# EAGLE design IR_Sync_Emitter with sensor (EAGLE 6.3)
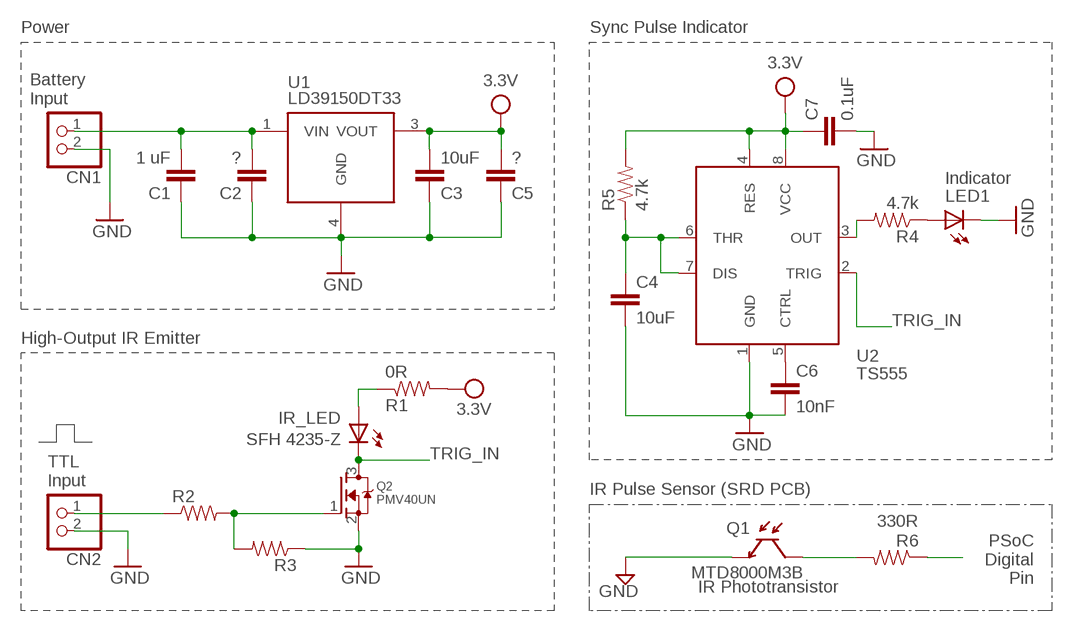
[diagram p0: schematic, sheet 1]

## Parts
C1  1 uF  CC0805-N  [CAPC2012X100N]
C2  ?  CC0805-N  [CAPC2012X100N]
C3  10uF  CC0805-N  [CAPC2012X100N]
C4  10uF  CC0805-N  [CAPC2012X100N]
C5  ?  CC0805-N  [CAPC2012X100N]
C6  10nF  CC0805-N  [CAPC2012X100N]
C7  0.1uF  CC0805-N  [CAPC2012X100N]
CN1  JST_2PIN-SMT-RA  [JST-PH-2-SMT-RA]
CN2  JST_2PIN-SMT-RA  [JST-PH-2-SMT-RA]
IR_LED  LEDIR_SMT16.2X11.2  [LED_SMT6.2X11.2]
LED1  LED0603  [CHIPLED_0603]
Q1  MTD8000M3B  PHOTOTRANSISTOR  [MTD8000M3B-T]
Q2  PMV40UN  MOSFET-NREFLOW  [SOT23]
R1  0R  RR1206-N  [RESC3116X65N]
R2  RR0805-N  [RESC2012X60N]
R3  RR0805-N  [RESC2012X60N]
R4  4.7k  RR0805-N  [RESC2012X60N]
R5  4.7k  RR0805-N  [RESC2012X60N]
R6  330R  RR0805-N  [RESC2012X60N]
U1  LM2931_FIXED  [DPAK]
U2  TS555  [SO08]

## Nets
GND: C1.1 C2.1 C3.1 C4.2 C5.1 C6.2 C7.2 CN1.2 CN2.2 LED1.C Q1.E Q2.2(S) R3.1 U1.4(GND) U2.1(GND)
N$2: LED1.A R4.1
N$3: Q2.1(G) R2.2 R3.2
N$4: C1.2 C2.2 CN1.1 U1.1(VIN)
N$5: IR_LED.A R1.1
N$6: Q1.C R6.2
N$7: CN2.1 R2.1
N$8: R6.1
N$9: R4.2 U2.3(OUT)
N$10: C4.1 R5.1 U2.6(THR) U2.7(DIS)
N$11: C6.1 U2.5(CTRL)
TRIG_IN: IR_LED.C Q2.3(D) U2.2(TRIG)
VDD: C3.2 C5.2 C7.1 R1.2 R5.2 U1.3(VOUT) U2.4(RES) U2.8(VCC)

## Notes on the sheet
- Power | Sync Pulse Indicator
- 3.3V
- 3.3V
- Battery
  Input
- LD39150DT33
- Indicator
- High-Output IR Emitter
- 3.3V
- SFH 4235-Z
- TTL
  Input
- IR Pulse Sensor (SRD PCB)
- PSoC
  Digital
  Pin
- IR Phototransistor

## Library data of the parts
C1-C7 = Ramshur:C: Capacitor (english/metric) cermaic capacitor nominal landpattern (N).
CN1 CN2 = _adafruit:JST_2PIN: JST 2-Pin Connectors of various flavors SMT-RA (S2B-PH-SM4) 4UConnector #17311 SMT (B2B-PH-SM4) THM-RA (S2B-PH) THM (B2B-PH)
IR_LED LED1 = Ramshur:LED: LED
Q1 = Ramshur:PHOTOTRANSISTOR: phototransistor
Q2 = _adafruit:MOSFET-N: N-Channel Mosfet 2N7002E - 60V 260mA SOT23 [Digikey: 2N7002ET1GOSTR-ND] - REEL BSH103 - 30V 850mA SOT23 [Digikey: 568-5013-1-ND]
R1-R6 = Ramshur:R: Resistor Basic schematic elements and footprints for 0603, 1206, and PTH resistors.
U1 = SparkFun-PowerIC:LM2931_FIXED: LDO regulator with reverse battery protection- very durable!
U2 = Ramshur:TS555

## Board
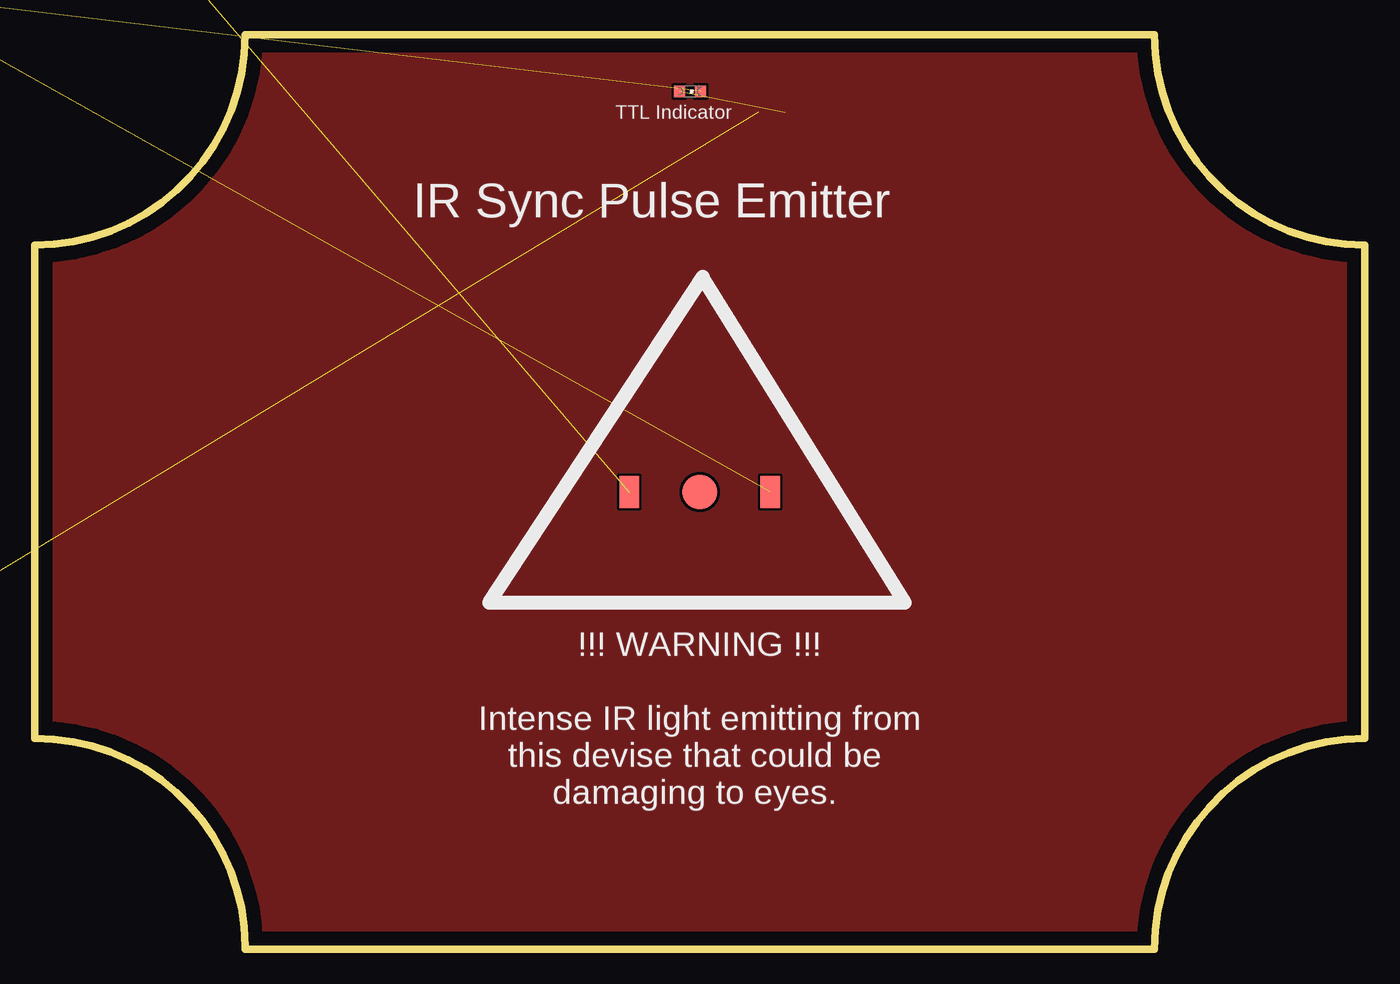
[diagram p1: board, top side]
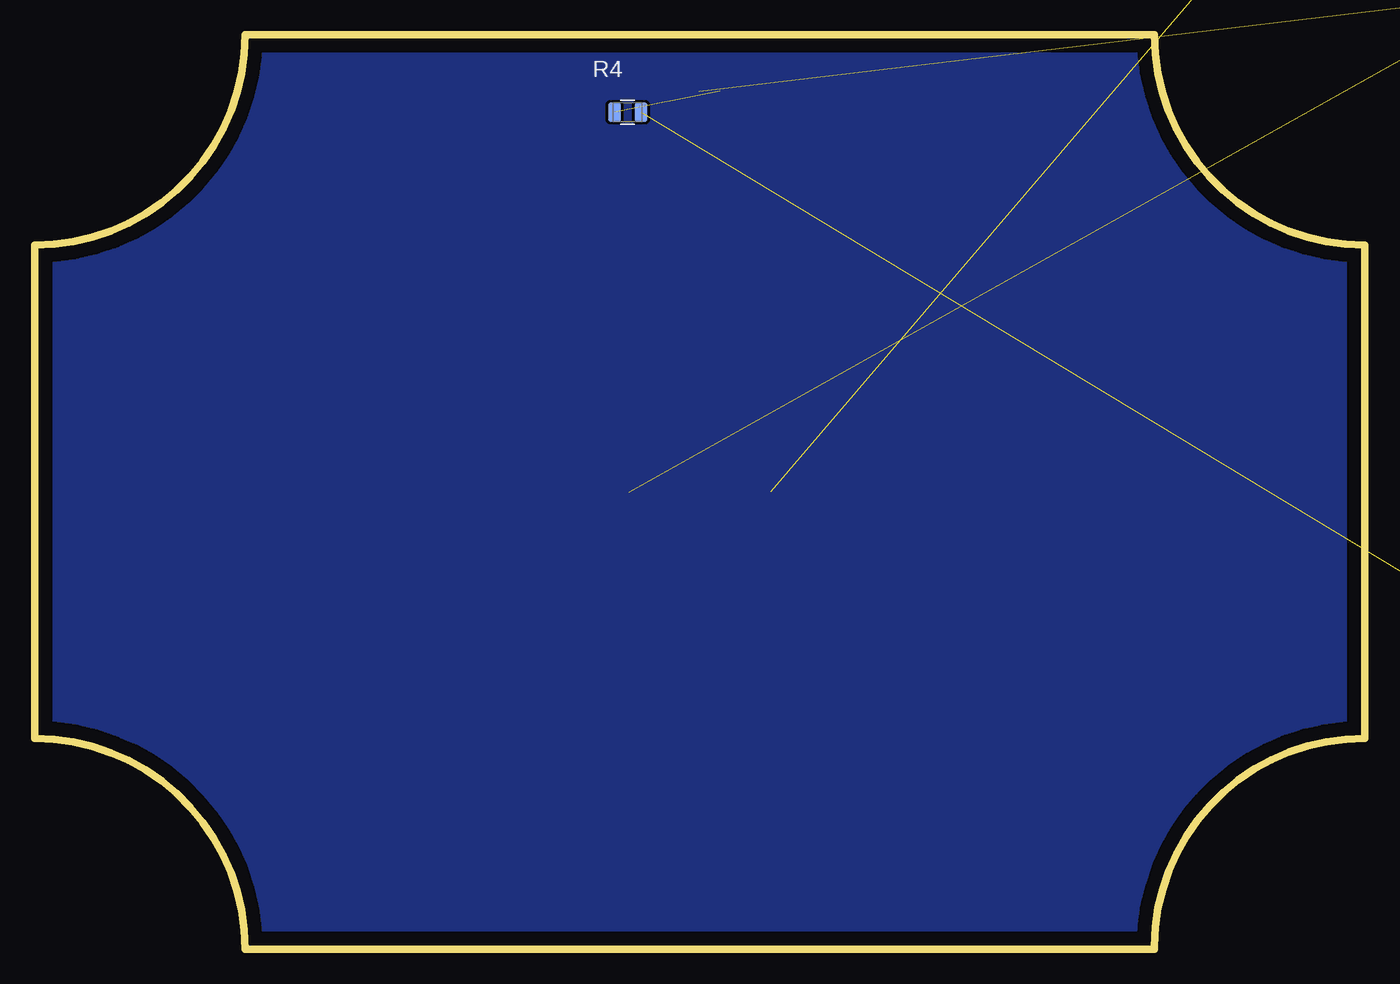
[diagram p2: board, bottom side, seen from below]

Size 96 x 66 mm. Coordinates in mm from the lower left corner, seen from the top.
Outline: 0,50.8 0,15.2 arc-90 15.2,0.2 15.2,0 80.8,0 arc-90 96,15.2 96,50.8 arc-90 80.8,66 15.2,66 arc-90 0,50.8
Outline: 0.1,50.8 0,50.8
Copper layers (1*16): Top 0.035mm / dielectric 1.5mm / Bottom 0.035mm
Design rules "default": minimum track width 10mil, minimum drill 24mil, track to track 8mil, track to pad 8mil, pad to pad 8mil, via to via 8mil, smd to smd 8mil, copper to edge 40mil, drill to drill 8mil, minimum pad ring 10mil, minimum via ring 8mil, stop-mask expansion 4mil, vias tented up to drill 0mil, thermal gap 10mil

### Footprints (pad centres in the part's own frame; a part is rotated, then mirrored left to right if it is on the bottom)
CAPC2012X100N = smd 1.05 x 1.3: 1 -1.1,0; 2 1.1,0
JST-PH-2-SMT-RA = smd 1 x 4.6: 1 1,-3.7; 2 -1,-3.7 | smd 1.6 x 3.4: NC1 -3.4,1.5; NC2 3.4,1.5
LED_SMT6.2X11.2 = smd 1.4 x 2.3: A -5.1,0; C 5.1,0 | smd 2.5 x 2.5: PAD 0,0
CHIPLED_0603 = smd 0.8 x 0.8: A 0,-0.75; C 0,0.75
MTD8000M3B-T = drill 0.47 pad 0.78 offset: C 0,0 | drill 0.32 pad 0.63 offset: E -0.9,0
SOT23 = smd 1 x 1.4: 1 -0.95,-1.1; 2 0.95,-1.1; 3 0,1.1
RESC3116X65N = smd 1.02 x 1.73: 1 -1.455,0; 2 1.455,0
RESC2012X60N = smd 0.92 x 1.38: 1 -0.955,0; 2 0.955,0
DPAK = smd 1.6 x 3: 1 -2.28,-5.31; 3 2.28,-5.31 | smd 4.826 x 5.715: 4 0,1.588
SO08 = smd 0.66 x 2.032: 1 -1.905,-3.073; 2 -0.635,-3.073; 3 0.635,-3.073; 4 1.905,-3.073; 5 1.905,3.073; 6 0.635,3.073; 7 -0.635,3.073; 8 -1.905,3.073

### Placement (x,y rotation side)
C1  -18,120 90 bottom  (outside the outline)
C2  -22.6,120 90 bottom  (outside the outline)
C3  -3.2,120.4 90 bottom  (outside the outline)
C4  -48.3,-9.7 0 top  (outside the outline)
C5  0.3,120.5 90 bottom  (outside the outline)
C6  -48.3,-14.9 0 top  (outside the outline)
C7  -48.3,-20.1 0 top  (outside the outline)
CN1  23.9,124.3 0 bottom  (outside the outline)
CN2  -27.7,68 270 bottom  (outside the outline)
IR_LED  48,33 0 top
LED1  47.3,61.9 270 top
Q1  -53.3,-21.5 0 top  (outside the outline)
Q2  -10.76,68.16 90 bottom  (outside the outline)
R1  -10.16,93.37 0 bottom  (outside the outline)
R2  -17.67,68.02 270 bottom  (outside the outline)
R3  -14.82,68.14 270 bottom  (outside the outline)
R4  53.2,60.4 0 bottom
R5  -48.3,-4.5 0 top  (outside the outline)
R6  -52.1,-27.3 0 top  (outside the outline)
U1  -11,115.8 180 bottom  (outside the outline)
U2  -46.8,4 0 top  (outside the outline)

### Tracks (layer width: path | path; a pad name or v marks a point on that pad's centre or on a via)
BND
  pour Bottom: 15.2,66 80.8,66 arc90 96,50.8 96,15.2 95.9,15.2 arc90 80.8,0 15.2,0 arc90 0.1,15.2 0,15.2 0,50.8 arc90
GND  (14 unrouted)
N$1
  pour Top: 15.2,66 80.8,66 arc90 96,50.8 96,15.2 95.9,15.2 arc90 80.8,0 15.2,0 arc90 0.1,15.2 0,15.2 0,50.8 arc90
N$2  (1 unrouted)
N$3  (2 unrouted)
N$4  (3 unrouted)
N$5  (1 unrouted)
N$6  (1 unrouted)
N$7  (1 unrouted)
N$9  (1 unrouted)
N$10  (3 unrouted)
N$11  (1 unrouted)
TRIG_IN  (2 unrouted)
VDD  (7 unrouted)

### Text on the board
tPlace: TTL Indicator | IR Sync Pulse Emitter | !!! WARNING !!! / / Intense IR light emitting from / this devise that could be / damaging to eyes.